# Altium schematic sheet RTM_Connectors.SchDoc: RTM
size 420 x 297 mm; Author: G.K.; CompanyName: WUT; DrawnBy: G.K.; Organization: CERN; Address1: Warsaw Univeristy of Technology; Address2: Nowowiejska 15/19; DocumentNumber: 4; Revision: -; SheetNumber: 4; SheetTotal: -; EDA_Number: ARTIQ; Projet: RTM 4SFP 3QSFP; ModifiedBy: -; CreateDate: XX/XX/XXXX; CheckedDate: -; Title2: connector; DivGrp: ISE; Designer: G.K.; ModifiedDate: -; ProjectName: RTM 4SFP 3QSFP
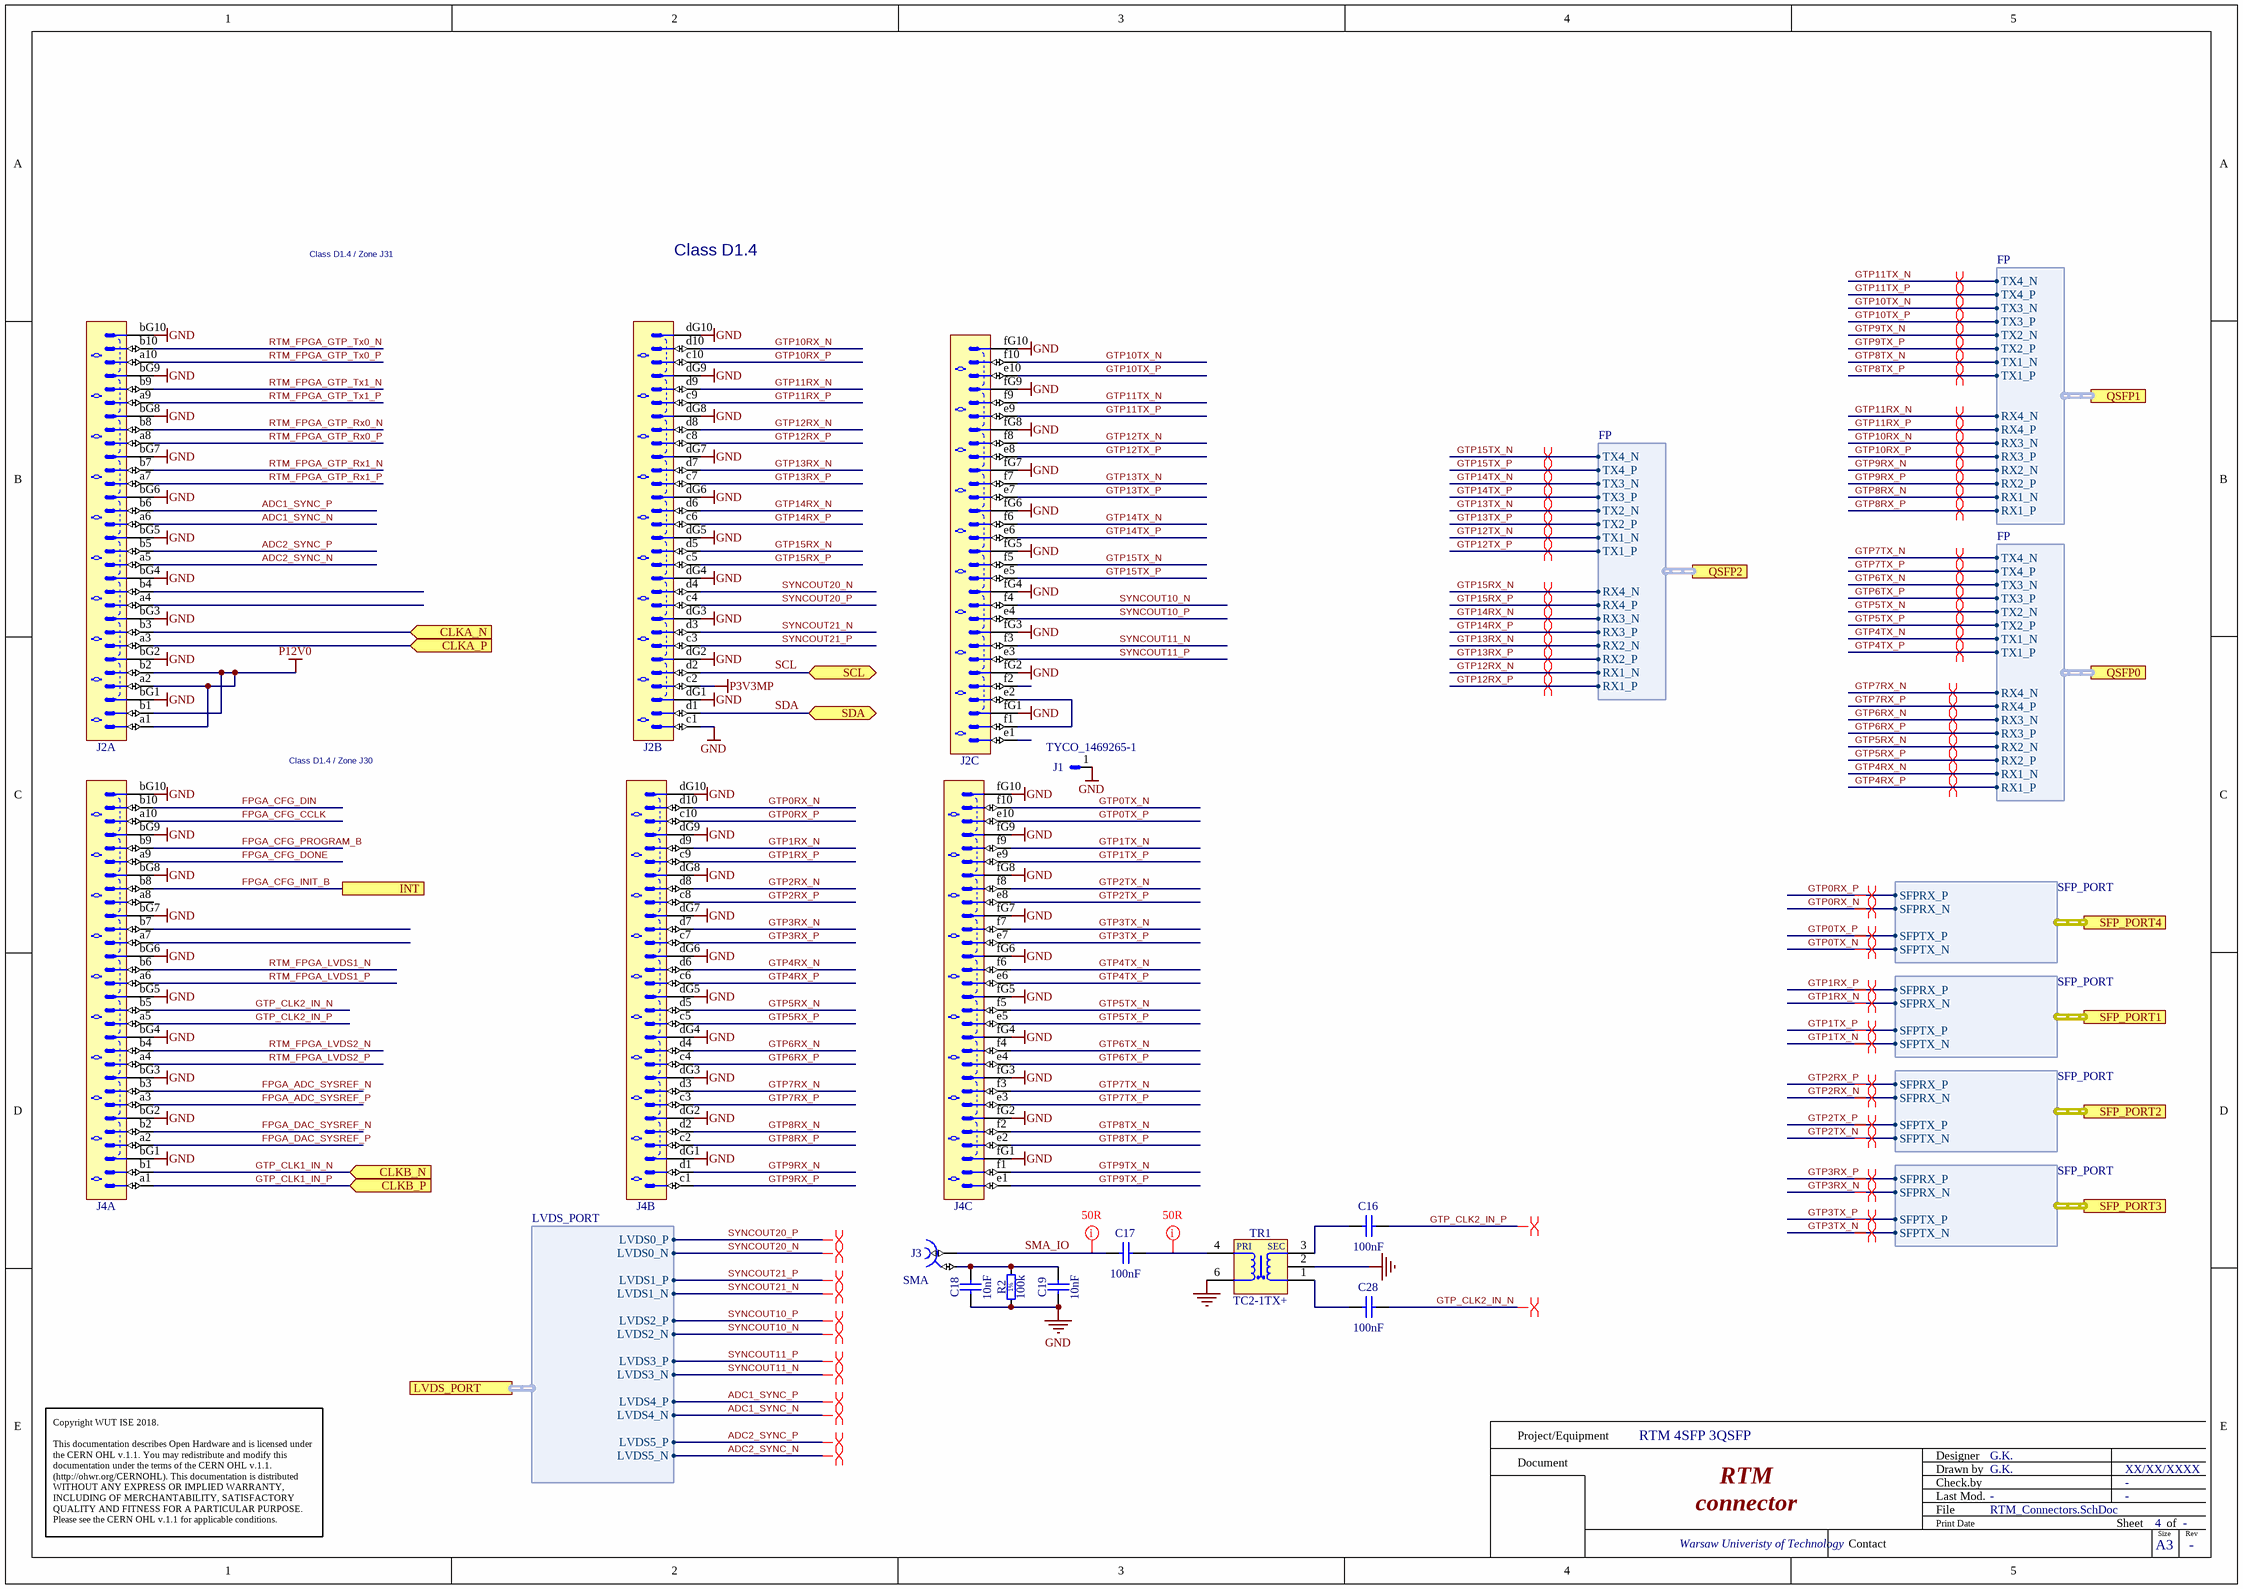
[diagram p0: RTM_Connectors.SchDoc]

## Parts
C16  100nF  [CAPC0603X33N]
C17  100nF  [CAPC0603X33N]
C18  10nF  [CAPC1005X55N]
C19  10nF  [CAPC1005X55N]
C28  100nF  [CAPC0603X33N]
J1  TYCO_1469265-1  [TYCO_1469265-1]
J2  Advanced TCA  [TYCO_6469183-1]  (value not drawn)  (parts A,B,C of 3)
J3  SMA  [AMPHENOL_132203]
J4  Advanced TCA  [TYCO_6469183-1]  (value not drawn)  (parts A,B,C of 3)
R2  100k  [RESC1005X40N]
TR1  TC2-1TX+  [XFMR_MINI-CIRCUITS_AT1521]

## Ports
CLKA_N (in), CLKA_P (in), CLKB_N (in), CLKB_P (in), INT (in), LVDS_PORT (harness LVDS_PORT), QSFP0 (harness FP), QSFP1 (harness FP), QSFP2 (harness FP), SCL (bidir), SDA (bidir), SFP_PORT1 (harness SFP_PORT), SFP_PORT2 (harness SFP_PORT), SFP_PORT3 (harness SFP_PORT), SFP_PORT4 (harness SFP_PORT)

## Harnesses
SFP_PORT: SFPRX_P, SFPRX_N, SFPTX_P, SFPTX_N
FP: RX1_P, RX1_N, RX2_N, RX2_P, TX1_P, TX1_N, TX2_N, TX2_P, RX3_P, RX3_N, RX4_N, RX4_P, TX3_P, TX3_N, TX4_N, TX4_P
LVDS_PORT: LVDS0_P, LVDS0_N, LVDS1_P, LVDS1_N, LVDS2_P, LVDS2_N, LVDS3_P, LVDS3_N, LVDS4_P, LVDS4_N, LVDS5_P, LVDS5_N

## Nets
GND: C18.1 C19.1 J1.1 J2.bG1 J2.bG2 J2.bG3 J2.bG4 J2.bG5 J2.bG6 J2.bG7 J2.bG8 J2.bG9 J2.bG10 J2.c1 J2.dG1 J2.dG2 J2.dG3 J2.dG4 J2.dG5 J2.dG6 J2.dG7 J2.dG8 J2.dG9 J2.dG10 J2.fG1 J2.fG2 J2.fG3 J2.fG4 J2.fG5 J2.fG6 J2.fG7 J2.fG8 J2.fG9 J2.fG10 J4.bG1 J4.bG2 J4.bG3 J4.bG4 J4.bG5 J4.bG6 J4.bG7 J4.bG8 J4.bG9 J4.bG10 J4.dG1 J4.dG2 J4.dG3 J4.dG4 J4.dG5 J4.dG6 J4.dG7 J4.dG8 J4.dG9 J4.dG10 J4.fG1 J4.fG2 J4.fG3 J4.fG4 J4.fG5 J4.fG6 J4.fG7 J4.fG8 J4.fG9 J4.fG10 R2.1 TR1.2(NU) TR1.6(PDOT)
P3V3MP: J2.c2
P12V0: J2.a1 J2.a2 J2.b1 J2.b2
ADC1_SYNC_N: J2.a6 ; port LVDS_PORT.LVDS4_N
ADC1_SYNC_P: J2.b6 ; port LVDS_PORT.LVDS4_P
ADC2_SYNC_N: J2.a5 ; port LVDS_PORT.LVDS5_N
ADC2_SYNC_P: J2.b5 ; port LVDS_PORT.LVDS5_P
CLKA_N: J2.b3 ; port CLKA_N
CLKA_P: J2.a3 ; port CLKA_P
FPGA_ADC_SYSREF_N: J4.b3
FPGA_ADC_SYSREF_P: J4.a3
FPGA_CFG_CCLK: J4.a10
FPGA_CFG_DIN: J4.b10
FPGA_CFG_DONE: J4.a9
FPGA_CFG_INIT_B: J4.b8
FPGA_CFG_PROGRAM_B: J4.b9
FPGA_DAC_SYSREF_N: J4.b2
FPGA_DAC_SYSREF_P: J4.a2
GTP0RX_N: J4.d10 ; port SFP_PORT4.SFPRX_N
GTP0RX_P: J4.c10 ; port SFP_PORT4.SFPRX_P
GTP0TX_N: J4.f10 ; port SFP_PORT4.SFPTX_N
GTP0TX_P: J4.e10 ; port SFP_PORT4.SFPTX_P
GTP1RX_N: J4.d9 ; port SFP_PORT1.SFPRX_N
GTP1RX_P: J4.c9 ; port SFP_PORT1.SFPRX_P
GTP1TX_N: J4.f9 ; port SFP_PORT1.SFPTX_N
GTP1TX_P: J4.e9 ; port SFP_PORT1.SFPTX_P
GTP2RX_N: J4.d8 ; port SFP_PORT2.SFPRX_N
GTP2RX_P: J4.c8 ; port SFP_PORT2.SFPRX_P
GTP2TX_N: J4.f8 ; port SFP_PORT2.SFPTX_N
GTP2TX_P: J4.e8 ; port SFP_PORT2.SFPTX_P
GTP3RX_N: J4.d7 ; port SFP_PORT3.SFPRX_N
GTP3RX_P: J4.c7 ; port SFP_PORT3.SFPRX_P
GTP3TX_N: J4.f7 ; port SFP_PORT3.SFPTX_N
GTP3TX_P: J4.e7 ; port SFP_PORT3.SFPTX_P
GTP4RX_N: J4.d6 ; port QSFP0.RX1_N
GTP4RX_P: J4.c6 ; port QSFP0.RX1_P
GTP4TX_N: J4.f6 ; port QSFP0.TX1_N
GTP4TX_P: J4.e6 ; port QSFP0.TX1_P
GTP5RX_N: J4.d5 ; port QSFP0.RX2_N
GTP5RX_P: J4.c5 ; port QSFP0.RX2_P
GTP5TX_N: J4.f5 ; port QSFP0.TX2_N
GTP5TX_P: J4.e5 ; port QSFP0.TX2_P
GTP6RX_N: J4.d4 ; port QSFP0.RX3_N
GTP6RX_P: J4.c4 ; port QSFP0.RX3_P
GTP6TX_N: J4.f4 ; port QSFP0.TX3_N
GTP6TX_P: J4.e4 ; port QSFP0.TX3_P
GTP7RX_N: J4.d3 ; port QSFP0.RX4_N
GTP7RX_P: J4.c3 ; port QSFP0.RX4_P
GTP7TX_N: J4.f3 ; port QSFP0.TX4_N
GTP7TX_P: J4.e3 ; port QSFP0.TX4_P
GTP8RX_N: J4.d2 ; port QSFP1.RX1_N
GTP8RX_P: J4.c2 ; port QSFP1.RX1_P
GTP8TX_N: J4.f2 ; port QSFP1.TX1_N
GTP8TX_P: J4.e2 ; port QSFP1.TX1_P
GTP9RX_N: J4.d1 ; port QSFP1.RX2_N
GTP9RX_P: J4.c1 ; port QSFP1.RX2_P
GTP9TX_N: J4.f1 ; port QSFP1.TX2_N
GTP9TX_P: J4.e1 ; port QSFP1.TX2_P
GTP10RX_N: J2.d10 ; port QSFP1.RX3_N
GTP10RX_P: J2.c10 ; port QSFP1.RX3_P
GTP10TX_N: J2.f10 ; port QSFP1.TX3_N
GTP10TX_P: J2.e10 ; port QSFP1.TX3_P
GTP11RX_N: J2.d9 ; port QSFP1.RX4_N
GTP11RX_P: J2.c9 ; port QSFP1.RX4_P
GTP11TX_N: J2.f9 ; port QSFP1.TX4_N
GTP11TX_P: J2.e9 ; port QSFP1.TX4_P
GTP12RX_N: J2.d8 ; port QSFP2.RX1_N
GTP12RX_P: J2.c8 ; port QSFP2.RX1_P
GTP12TX_N: J2.f8 ; port QSFP2.TX1_N
GTP12TX_P: J2.e8 ; port QSFP2.TX1_P
GTP13RX_N: J2.d7 ; port QSFP2.RX2_N
GTP13RX_P: J2.c7 ; port QSFP2.RX2_P
GTP13TX_N: J2.f7 ; port QSFP2.TX2_N
GTP13TX_P: J2.e7 ; port QSFP2.TX2_P
GTP14RX_N: J2.d6 ; port QSFP2.RX3_N
GTP14RX_P: J2.c6 ; port QSFP2.RX3_P
GTP14TX_N: J2.f6 ; port QSFP2.TX3_N
GTP14TX_P: J2.e6 ; port QSFP2.TX3_P
GTP15RX_N: J2.d5 ; port QSFP2.RX4_N
GTP15RX_P: J2.c5 ; port QSFP2.RX4_P
GTP15TX_N: J2.f5 ; port QSFP2.TX4_N
GTP15TX_P: J2.e5 ; port QSFP2.TX4_P
GTP_CLK1_IN_N: J4.b1 ; port CLKB_N
GTP_CLK1_IN_P: J4.a1 ; port CLKB_P
GTP_CLK2_IN_N: C28.2 J4.b5
GTP_CLK2_IN_P: C16.2 J4.a5
RTM_FPGA_GTP_Rx0_N: J2.b8
RTM_FPGA_GTP_Rx0_P: J2.a8
RTM_FPGA_GTP_Rx1_N: J2.b7
RTM_FPGA_GTP_Rx1_P: J2.a7
RTM_FPGA_GTP_Tx0_N: J2.b10
RTM_FPGA_GTP_Tx0_P: J2.a10
RTM_FPGA_GTP_Tx1_N: J2.b9
RTM_FPGA_GTP_Tx1_P: J2.a9
RTM_FPGA_LVDS1_N: J4.b6
RTM_FPGA_LVDS1_P: J4.a6
RTM_FPGA_LVDS2_N: J4.b4
RTM_FPGA_LVDS2_P: J4.a4
SCL: J2.d2 ; port SCL
SDA: J2.d1 ; port SDA
SMA_IO: C17.1 J3.1
SYNCOUT10_N: J2.f4 ; port LVDS_PORT.LVDS2_N
SYNCOUT10_P: J2.e4 ; port LVDS_PORT.LVDS2_P
SYNCOUT11_N: J2.f3 ; port LVDS_PORT.LVDS3_N
SYNCOUT11_P: J2.e3 ; port LVDS_PORT.LVDS3_P
SYNCOUT20_N: J2.d4 ; port LVDS_PORT.LVDS0_N
SYNCOUT20_P: J2.c4 ; port LVDS_PORT.LVDS0_P
SYNCOUT21_N: J2.d3 ; port LVDS_PORT.LVDS1_N
SYNCOUT21_P: J2.c3 ; port LVDS_PORT.LVDS1_P
NetC16_1: C16.1 TR1.3(S)
NetC17_2: C17.2 TR1.4(P)
NetC18_2: C18.2 C19.2 J3.2 R2.2
NetC28_1: C28.1 TR1.1(SDOT)
NetJ2_e2: J2.e2 J2.f1

Not connected (* = marked no-connect by the designer): J2 a4 b4 e1 f2; J4 a7 a8 b7

## Layout directives
differential pair: GTP0RX_N, GTP0RX_P, GTP0TX_N, GTP0TX_P, GTP1RX_N, GTP1RX_P, GTP1TX_N, GTP1TX_P, GTP2RX_N, GTP2RX_P, GTP2TX_N, GTP2TX_P, GTP3RX_N, GTP3RX_P, GTP3TX_N, GTP3TX_P, GTP4RX_N, GTP4RX_P, GTP4TX_N, GTP4TX_P, GTP5RX_N, GTP5RX_P, GTP5TX_N, GTP5TX_P, GTP6RX_N, GTP6RX_P, GTP6TX_N, GTP6TX_P, GTP7RX_N, GTP7RX_P, GTP7TX_N, GTP7TX_P, GTP8RX_N, GTP8RX_P, GTP8TX_N, GTP8TX_P, GTP9RX_N, GTP9RX_P, GTP9TX_N, GTP9TX_P, GTP10RX_N, GTP10RX_P, GTP10TX_N, GTP10TX_P, GTP11RX_N, GTP11RX_P, GTP11TX_N, GTP11TX_P, GTP12RX_N, GTP12RX_P, GTP12TX_N, GTP12TX_P, GTP13RX_N, GTP13RX_P, GTP13TX_N, GTP13TX_P, GTP14RX_N, GTP14RX_P, GTP14TX_N, GTP14TX_P, GTP15RX_N, GTP15RX_P, GTP15TX_N, GTP15TX_P
differential pair; net class Diff_100Ohm: ADC1_SYNC_N, ADC1_SYNC_P, ADC2_SYNC_N, ADC2_SYNC_P, GTP_CLK2_IN_N, GTP_CLK2_IN_P, SYNCOUT10_N, SYNCOUT10_P, SYNCOUT11_N, SYNCOUT11_P, SYNCOUT20_N, SYNCOUT20_P, SYNCOUT21_N, SYNCOUT21_P
net class 50R: NetC17_2, SMA_IO

## Notes on the sheet
- Class D1.4 / Zone J31
- Class D1.4
- Class D1.4 / Zone J30
- Project/Equipment
- Document
- Designer
- Drawn by
- Check.by
- Copyright WUT ISE 2018.
  This documentation describes Open Hardware and is licensed under the CERN OHL v.1.1. You may redistribute and modify this documentation under the terms of the CERN OHL v.1.1. (http://ohwr.org/CERNOHL). This documentation is distributed WITHOUT ANY EXPRESS OR IMPLIED WARRANTY, INCLUDING OF MERCHANTABILITY, SATISFACTORY QUALITY AND FITNESS FOR A PARTICULAR PURPOSE. Please see the CERN OHL v.1.1 for applicable conditions.
- Contact
- File
- Last Mod.
- Print Date
- Sheet
- Size
- A3
- of
- Rev
- (in symbol R0402_100K_1%_0.0625W_100PPM) 1%
- (in symbol XFMR_MINI-CIRCUITS_TC2-1TX+) PRI; SEC

## Library data of the parts
C16 C17 C28 = CC0201_100NF_6.3V_10%_X5R: Non-polarised capacitor; Part Description: SMD Multilayer Chip Ceramic Capacitor; Manufacturer: GENERIC; Manufacturer1 Part Number: 02016D104KAT2A; Voltage: 6.3V; TC: X5R; Tolerance: ±10%; Part Number: CC0201_100NF_6.3V_10%_X5R; Component Kind: Standard; Component Type: Standard; Pin Count: 2; Value: 100nF; Status: Not Recommended; Manufacturer Part Number: CC0201_100NF_6.3V_10%_X5R; Case: 0201; Mounted: Yes; Socket: No; SMD: Yes; Sense: No; Manufacturer1 Example: AVX; Manufacturer1 ComponentHeight: 0.33mm; HelpURL: \\cern.ch\dfs\Applications\Altium\Datasheets\CC0201_X5R_AVX.pdf; Author: CERN DEM JLC; CreateDate: 2007-12-03; LatestRevisionDate: 2007-12-03
C18 C19 = CC0402_10NF_16V_10%_X7R: Non-polarised capacitor; Part Description: SMD Multilayer Chip Ceramic Capacitor; Manufacturer: GENERIC; Manufacturer1 Part Number: 223878715636; Voltage: 16V; TC: X7R; Tolerance: ±10%; Part Number: CC0402_10NF_16V_10%_X7R; Component Kind: Standard; Component Type: Standard; Pin Count: 2; Value: 10nF; Status: Not Recommended; Manufacturer Part Number: CC0402_10NF_16V_10%_X7R; Case: 0402; Mounted: Yes; Socket: No; SMD: Yes; Sense: No; Manufacturer1 Example: PHYCOMP; Manufacturer1 ComponentHeight: 0.55mm; HelpURL: \\cern.ch\dfs\Applications\Altium\Datasheets\CC0402_X7R_PHYCOMP.pdf; Author: CERN DEM JLC; CreateDate: 03.12.2007; LatestRevisionDate: 03.12.2007
J1 = TYCO_1469265-1: Single Pin Male; Part Number: TYCO_1469265-1
J2 J4 = TYCO_6469183-1: Connector 60 ATCA Male 30 Pairs (60 Signals) + 3x10 Ground; Part Description: 60 Positions, Pitch 2.5mm,  Advanced TCA, Z-PACK HM-Zd Right Angle Press Fit Header; Manufacturer: TYCO ELECTRONICS; Part Number: TYCO_6469183-1; Component Kind: Standard; Component Type: Standard; Pin Count: 90; Family: Advanced TCA; Mounted: Yes; Socket: No; SMD: No; PressFit: Yes; Sense: No; Status: None; Manufacturer Part Number: 6469183-1; ComponentHeight: 13.31mm; HelpURL: \\cern.ch\dfs\Applications\Altium\Datasheets\TYCO_6469183-1.pdf; Author: CERN DEM JLC; CreateDate: 28.08.2013; LatestRevisionDate: 28.08.2013
J3 = AMPHENOL_132203: Part Description: 50 Ohm Through Hole SMA Right Angle PCB Jack; Manufacturer Part Number: 132203; PressFit: No; Part Number: AMPHENOL_132203; Component Kind: Standard; Component Type: Standard; Pin Count: 5; Family: SMA; Mounted: Yes; Socket: No; SMD: No; Sense: No; Status: None; Manufacturer: AMPHENOL; ComponentHeight: 10.44mm; HelpURL: \\cern.ch\dfs\Applications\Altium\Datasheets\AMPHENOL_132203.pdf; Author: CERN DEM MR; CreateDate: 2016-10-06; LatestRevisionDate: 2016-10-06; ClassName: Connectors
R2 = R0402_100K_1%_0.0625W_100PPM: Resistor - 1%; Part Description: General Purpose Thick Film Chip Resistor; Manufacturer: GENERIC; Manufacturer1 Part Number: 232270671004L; PressFit: No; TC: ±100ppm/°C; Part Number: R0402_100K_1%_0.0625W_100PPM; Component Kind: Standard; Component Type: Standard; Pin Count: 2; Value: 100k; Status: Not Recommended; Manufacturer Part Number: R0402_100K_1%_0.0625W_100PPM; Case: 0402; Mounted: Yes; Sense: No; Socket: No; SMD: Yes; Manufacturer1 Example: YAGEO PHYCOMP; Manufacturer1 ComponentHeight: 0.4mm; HelpURL: \\cern.ch\dfs\Applications\Altium\Datasheets\R0402_Phycomp_RC0402.pdf; Author: CERN DEM JLC; CreateDate: 03.12.2007; LatestRevisionDate: 17.10.2012; Power: 0.0625W; Tolerance: ±1%
TR1 = XFMR_MINI-CIRCUITS_TC2-1TX+: 50 Ohm 3 to 300MHz RF Transformers; Manufacturer: MINI-CIRCUITS; Manufacturer Part Number: TC2-1TX+; HelpURL: https://ww2.minicircuits.com/pdfs/TC2-1TX+.pdf